# Altium project РЕУН.468172.001_Драйвер лазера.PrjPCB
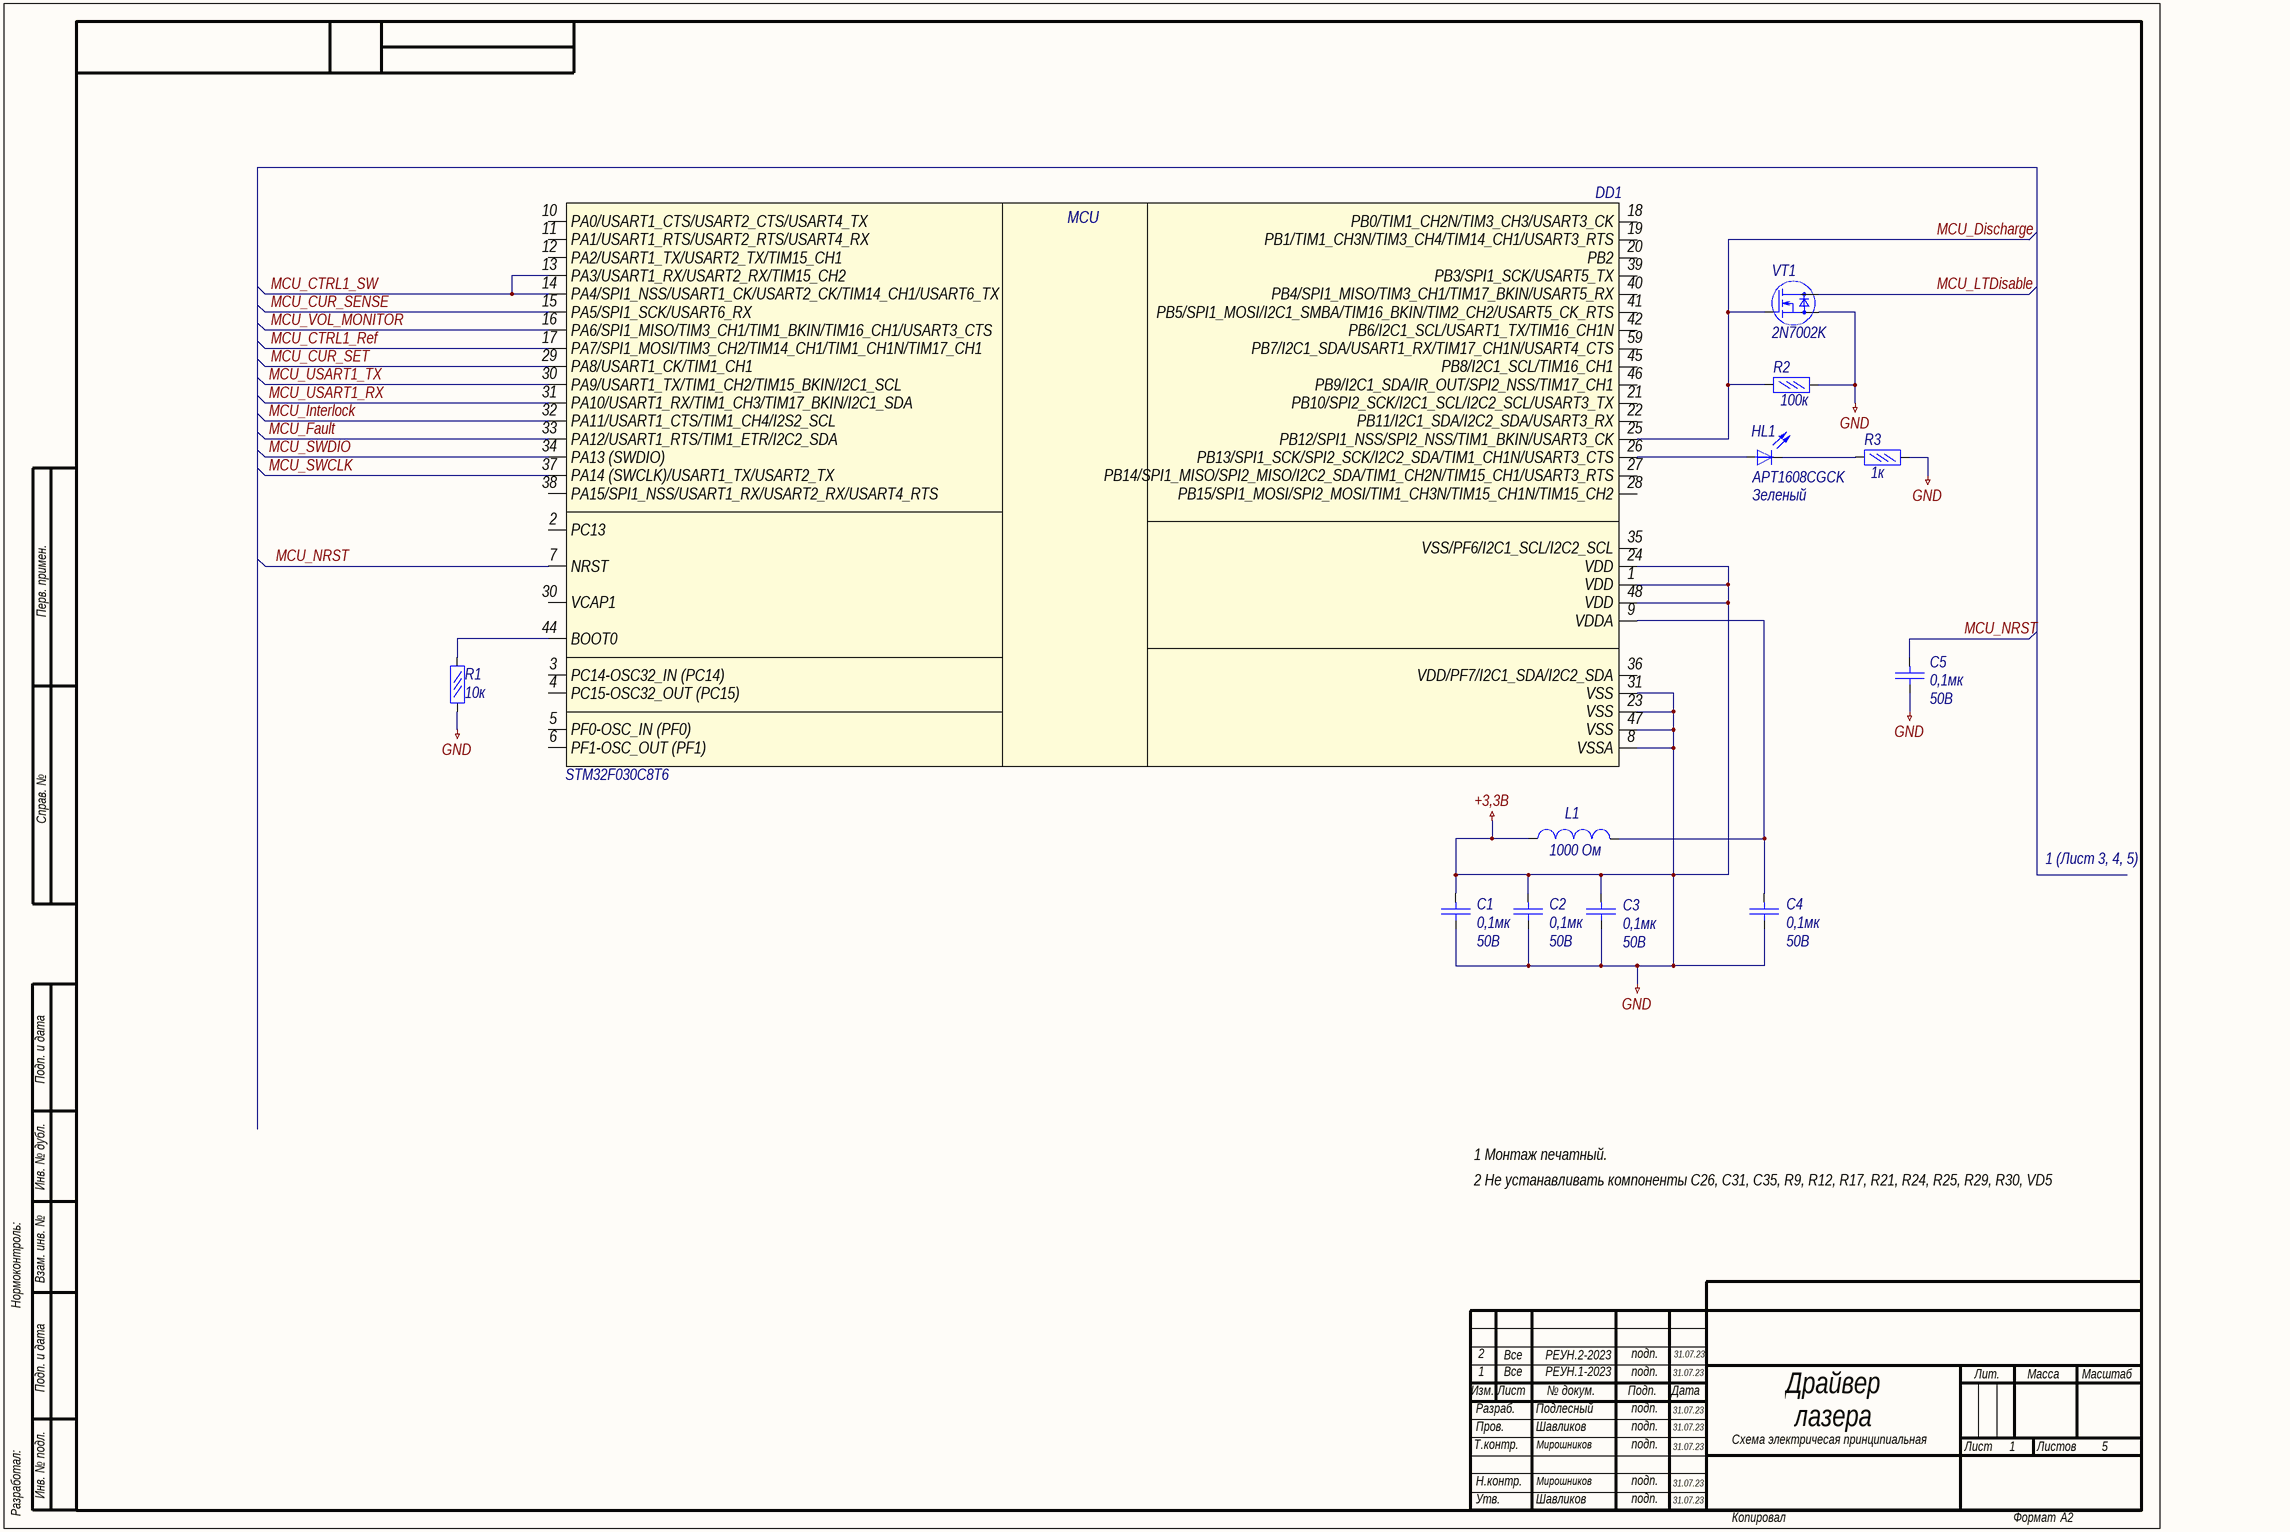
[diagram p0: РЕУН.468172.001_MCU.SchDoc]
5 sheets, 110 parts. Net scope: global (net labels, ports and power ports of the same name join across sheets).
Sheets:
  РЕУН.468172.001_MCU.SchDoc
  РЕУН.468172.001_Power.SchDoc
  РЕУН.468172.001_Int.SchDoc
  РЕУН.468172.001_Interface.SchDoc
  РЕУН.468172.001_Connectors.SchDoc

## Sheet РЕУН.468172.001_MCU.SchDoc: Драйвер
size 594 x 420 mm; ApprovedBy: Шавликов; CheckedBy: Шавликов; DrawnBy: Подлесный; DocumentNumber: РЕУН.468172.001 Э3 2D; SheetNumber: 1; SheetTotal: 5; Вид изделия: Документация; Раздел: Документация; Код документа: Э3; Вид документа: Схема электрическая принципиальная; Класс документа: Конструкторский документ; Создавать изделие в PLM: Yes; DocumentCode: РЕУН.468172.001 Э3 2D; DocumentView: Схема электрическая принципиальная; DocumentClass: Конструкторский документ; ProductView: Документация; DocName: Драйвер; Title_2: лазера; DocumentType: Схема электричесая принципиальная; Format: А2; Designation: РЕУН.468172.001 ТЭ; ImagePath: РЕУН.468172.001 ТЭ

### Parts
C1  Voltage: 50В  [C0805_AA]  (hidden comment: 0,1мк)
C2  Voltage: 50В  [C0805_AA]  (hidden comment: 0,1мк)
C3  Voltage: 50В  [C0805_AA]  (hidden comment: 0,1мк)
C4  Voltage: 50В  [C0805_AA]  (hidden comment: 0,1мк)
C5  Voltage: 50В  [C0805_AA]  (hidden comment: 0,1мк)
DD1  STM32F030C8T6
HL1  Color: Зеленый  (hidden comment: APT1608CGCK)
L1  1000 Ом  [L0603_A]
R1  10к  [R1206]
R2  100к  [R1206]
R3  1к  [R1206]
VT1  2N7002K  [SOT23-3]

### Nets
+3,3В: C1.1 C1.2 C2.1 C2.2 C3.1 C3.2 C4.1 C5.1 DD1.1(VDD) DD1.8(VSSA) DD1.23(VSS) DD1.24(VDD) DD1.31(VSS) DD1.47(VSS) DD1.48(VDD) L1.1 R1.1 R2.1 R3.1 VT1.2(S)  [also labelled GND]
MCU_CTRL1_Ref: DD1.17(PA7/SPI1_MOSI/TIM3_CH2/TIM14_CH1/TIM1_CH1N/TIM17_CH1)
MCU_CTRL1_SW: DD1.13(PA3/USART1_RX/USART2_RX/TIM15_CH2) DD1.14(PA4/SPI1_NSS/USART1_CK/USART2_CK/TIM14_CH1/USART6_TX)
MCU_CUR_SENSE: DD1.15(PA5/SPI1_SCK/USART6_RX)
MCU_CUR_SET: DD1.29(PA8/USART1_CK/TIM1_CH1)
MCU_Discharge: DD1.25(PB12/SPI1_NSS/SPI2_NSS/TIM1_BKIN/USART3_CK) R2.2 VT1.1(G)
MCU_Fault: DD1.33(PA12/USART1_RTS/TIM1_ETR/I2C2_SDA)
MCU_Interlock: DD1.32(PA11/USART1_CTS/TIM1_CH4/I2S2_SCL)
MCU_LTDisable: VT1.3(D)
MCU_NRST: C5.2 DD1.7(NRST)
MCU_SWCLK: DD1.37(PA14_(SWCLK)/USART1_TX/USART2_TX)
MCU_SWDIO: DD1.34(PA13_(SWDIO))
MCU_USART1_RX: DD1.31(PA10/USART1_RX/TIM1_CH3/TIM17_BKIN/I2C1_SDA)
MCU_USART1_TX: DD1.30(PA9/USART1_TX/TIM1_CH2/TIM15_BKIN/I2C1_SCL)
MCU_VOL_MONITOR: DD1.16(PA6/SPI1_MISO/TIM3_CH1/TIM1_BKIN/TIM16_CH1/USART3_CTS)
NetC4_2: C4.2 DD1.9(VDDA) L1.2
NetDD1_26: DD1.26(PB13/SPI1_SCK/SPI2_SCK/I2C2_SDA/TIM1_CH1N/USART3_CTS) HL1.1(A)
NetDD1_44: DD1.44(BOOT0) R1.2
NetHL1_2: HL1.2(K) R3.2

Not connected (* = marked no-connect by the designer): DD1 2(PC13) 3(PC14-OSC32_IN_(PC14)) 4(PC15-OSC32_OUT_(PC15)) 5(PF0-OSC_IN_(PF0)) 6(PF1-OSC_OUT_(PF1)) 10(PA0/USART1_CTS/USART2_CTS/USART4_TX) 11(PA1/USART1_RTS/USART2_RTS/USART4_RX) 12(PA2/USART1_TX/USART2_TX/TIM15_CH1) 18(PB0/TIM1_CH2N/TIM3_CH3/USART3_CK) 19(PB1/TIM1_CH3N/TIM3_CH4/TIM14_CH1/USART3_RTS) 20(PB2) 21(PB10/SPI2_SCK/I2C1_SCL/I2C2_SCL/USART3_TX) 22(PB11/I2C1_SDA/I2C2_SDA/USART3_RX) 27(PB14/SPI1_MISO/SPI2_MISO/I2C2_SDA/TIM1_CH2N/TIM15_CH1/USART3_RTS) 28(PB15/SPI1_MOSI/SPI2_MOSI/TIM1_CH3N/TIM15_CH1N/TIM15_CH2) 35(VSS/PF6/I2C1_SCL/I2C2_SCL) 36(VDD/PF7/I2C1_SDA/I2C2_SDA) 38(PA15/SPI1_NSS/USART1_RX/USART2_RX/USART4_RTS) 39(PB3/SPI1_SCK/USART5_TX) 40(PB4/SPI1_MISO/TIM3_CH1/TIM17_BKIN/USART5_RX) 41(PB5/SPI1_MOSI/I2C1_SMBA/TIM16_BKIN/TIM2_CH2/USART5_CK_RTS) 42(PB6/I2C1_SCL/USART1_TX/TIM16_CH1N) 45(PB8/I2C1_SCL/TIM16_CH1) 46(PB9/I2C1_SDA/IR_OUT/SPI2_NSS/TIM17_CH1) 59(PB7/I2C1_SDA/USART1_RX/TIM17_CH1N/USART4_CTS)

### Notes on the sheet
- 1 (Лист 3, 4, 5)
- 1 Монтаж печатный.
- 2 Не устанавливать компоненты C26, C31, C35, R9, R12, R17, R21, R24, R25, R29, R30, VD5
- 2
- Все
- РЕУН.2-2023
- подп.
- 31.07.23
- 1
- РЕУН.1-2023
- Мирошников
- Перв. примен.
- Справ. №
- Подп. и дата
- Инв. № дубл.
- Нормоконтроль:
- Взам. инв. №
- Изм.
- Лист
- № докум.
- Подп.
- Дата
- Лит.
- Масса
- Масштаб
- Т.контр.
- Пров.
- Разраб.
- Листов
- Разработал:
- Инв. № подл.
- Н.контр.
- Утв.
- Копировал
- Формат
- (in symbol STM32F030C8T6) MCU

### Library data of the parts
C1-C5 = Конденсатор кер.: Name: CC0603KRX7R9BB104; Value: 0,1мк
DD1 = STM32F030C8T6: 32-битный микроконтроллер; Name: STM32F030C8T6
HL1 = led: Светодиод; Name: APT1608CGCK
L1 = Inductor: Катушка индуктивности; Name: BLM18TG102TN1D; Value: 1000 Ом
R1-R3 = Резистор  0,05Вт: Резистор 0,05Вт; Name: RC0603FR-0710KL; Power rating: 0,05Вт
  R1: Value: 10к
  R2: Value: 100к
  R3: Value: 1к
VT1 = mosfet-n: Name: 2N7002K

## Sheet РЕУН.468172.001_Power.SchDoc: =Name-1str
size 420 x 297 mm; SheetNumber: 2; Вид изделия: Документация; Раздел: Документация; Код документа: Э3; Вид документа: Схема электрическая принципиальная; Класс документа: Конструкторский документ; Создавать изделие в PLM: Yes; DocumentCode: РЕУН.468172.001 Э3 2D; DocumentView: Схема электрическая принципиальная; DocumentClass: Конструкторский документ; ProductView: Документация; Format: А3
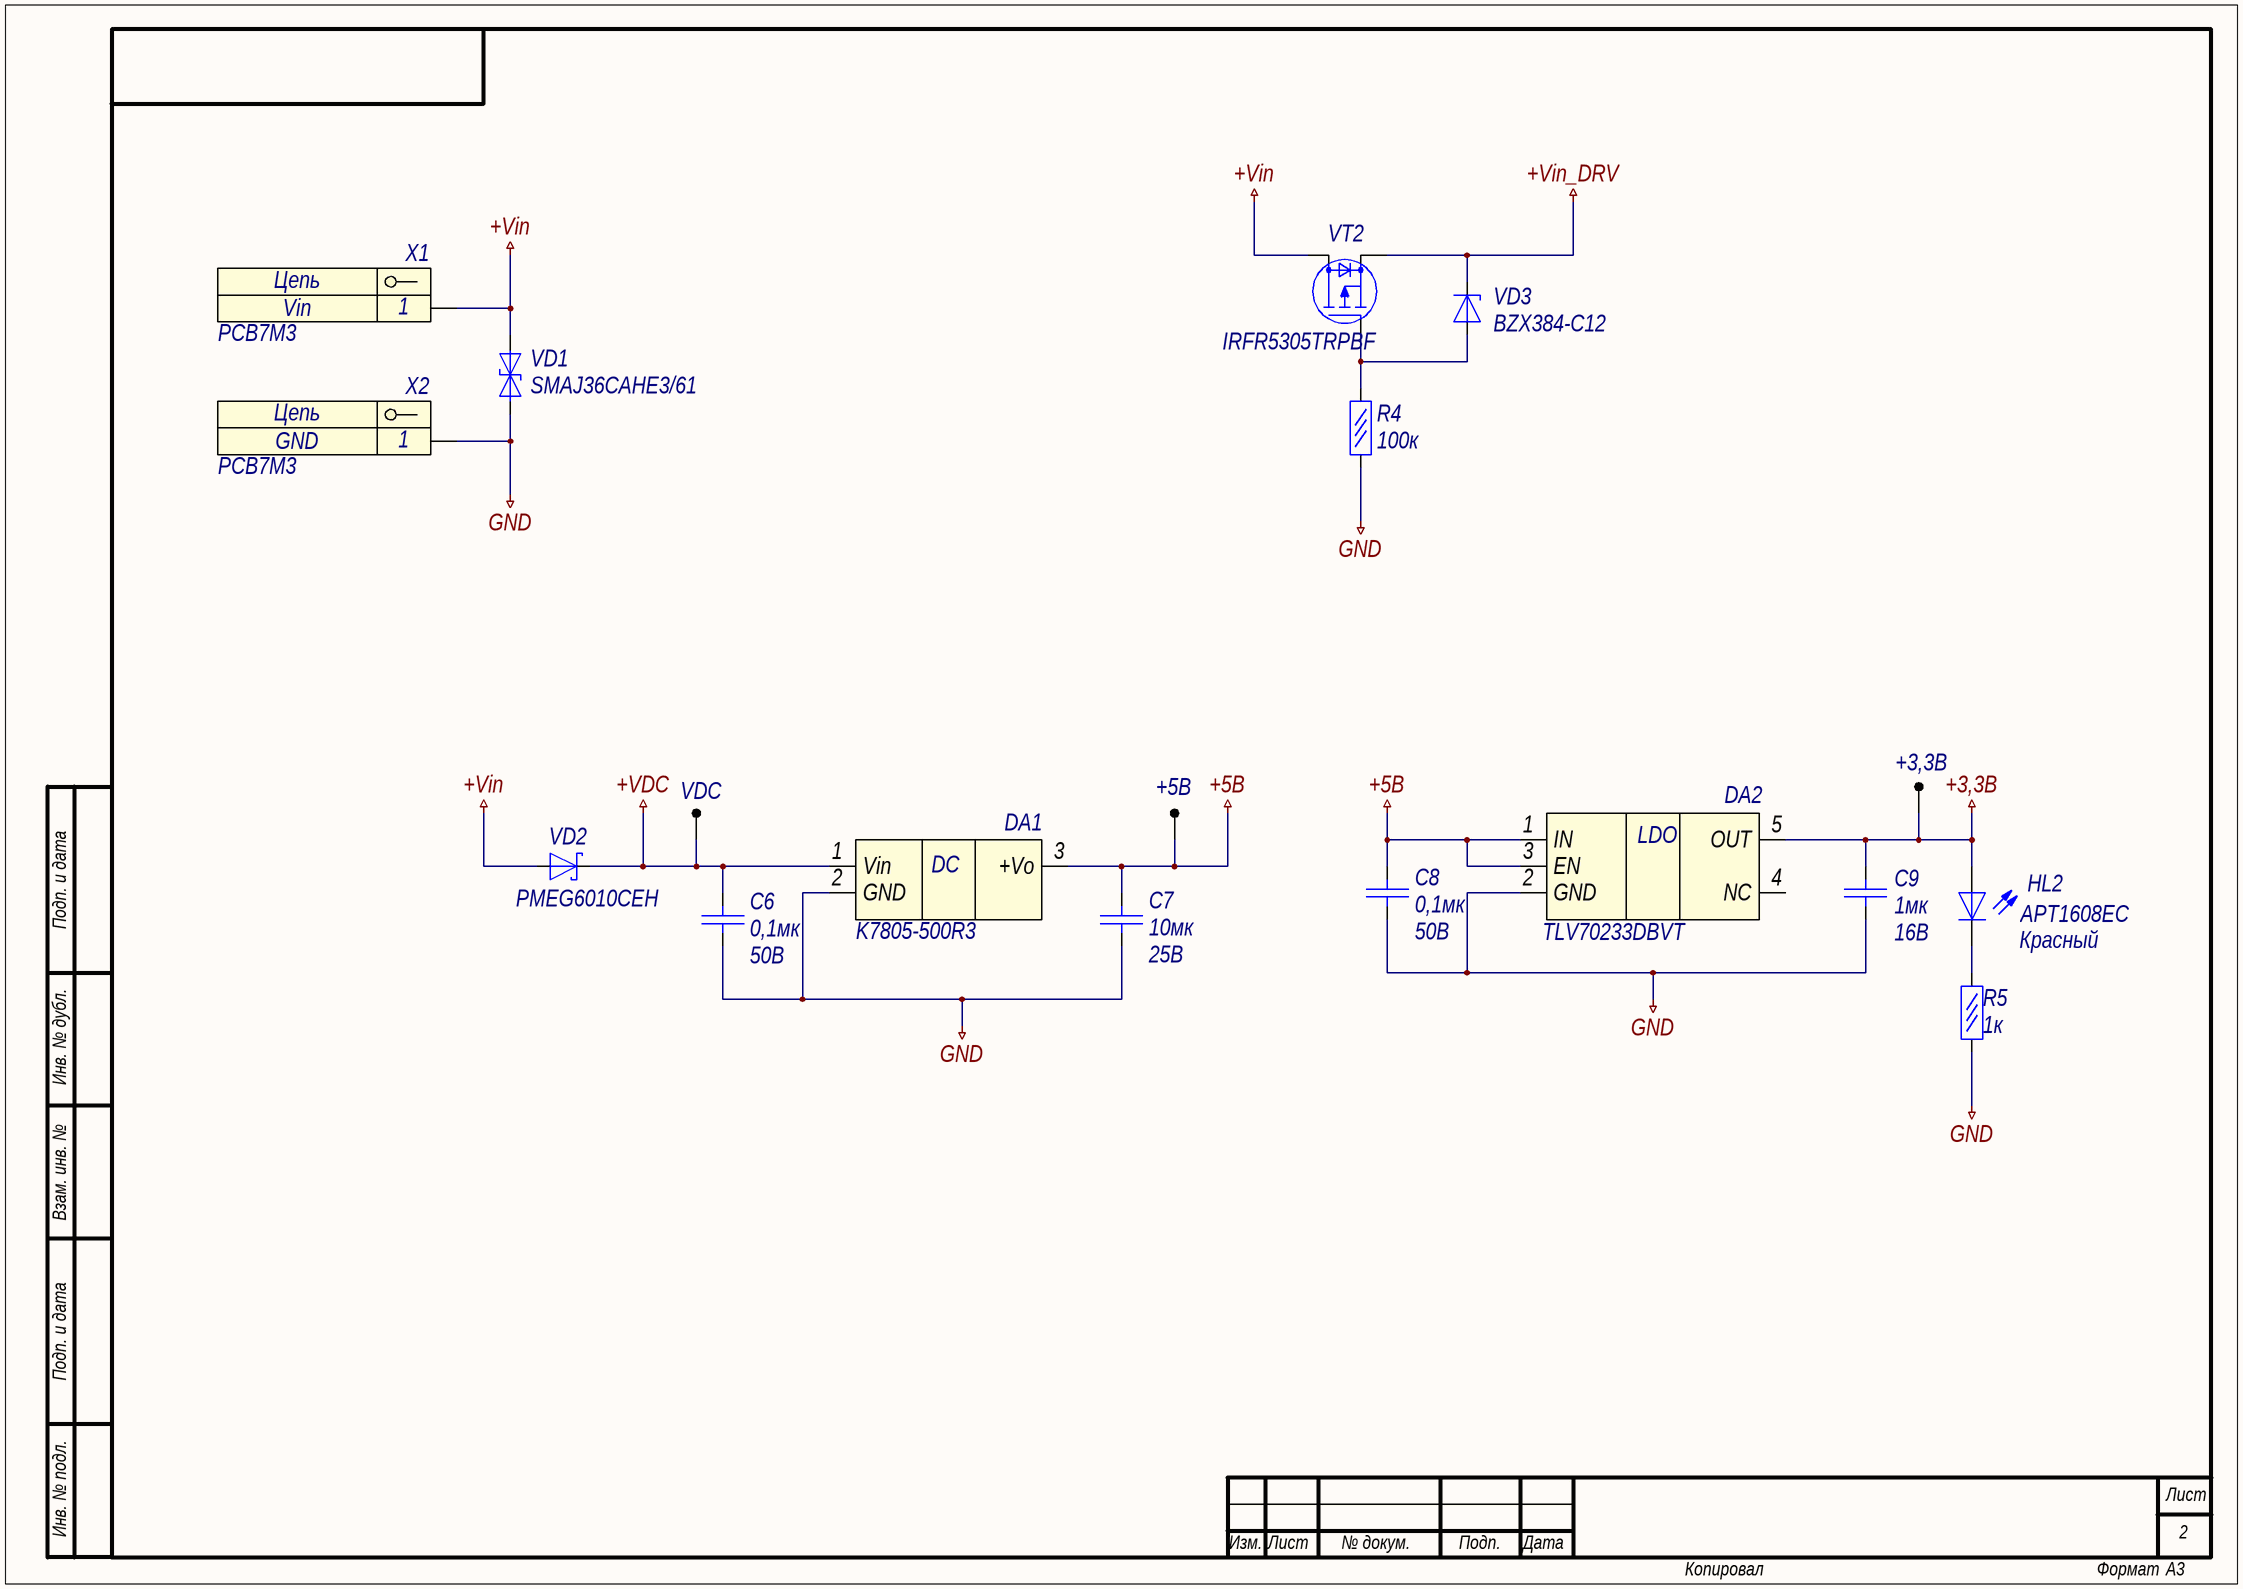
[diagram p1: РЕУН.468172.001_Power.SchDoc]

### Parts
+3,3В  "1"  [0.5 x 1_round]  (value not drawn)
+5В  "1"  [0.5 x 1_round]  (value not drawn)
C6  Voltage: 50В  [C0805_AA]  (hidden comment: 0,1мк)
C7  Voltage: 25В  [C0805_AA]  (hidden comment: 10мк)
C8  Voltage: 50В  [C0805_AA]  (hidden comment: 0,1мк)
C9  Voltage: 16В  [C0805_AA]  (hidden comment: 1мк)
DA1  K7805-500R3
DA2  TLV70233DBVT
HL2  APT1608EC  Vr: Красный  [D0603_A]
R4  100к  [R1206]
R5  1к  [R1206]
VD1  SMAJ36CAHE3/61
VD2  PMEG6010CEH  [SOD123_A]
VD3  BZX384-C12  [SOT23-2_A]
VDC  "1"  [0.5 x 1_round]  (value not drawn)
VT2  IRFR5305TRPBF  [SOT23-3_A]
X1  PCB7M3
X2  PCB7M3

### Nets
+3,3В: +3,3В.1 C6.1 C7.1 C8.1 C9.1 C9.2 DA1.2(GND) DA2.2(GND) DA2.5(OUT) HL2.1(Анод) R4.1 R5.1 VD1.1(A) X2.1  [also labelled GND]
+5В: +5В.1 C7.2 C8.2 DA1.3(+Vo) DA2.1(IN) DA2.3(EN)
+VDC: C6.2 DA1.1(Vin) VD2.1(K) VDC.1
+Vin: VD1.2(K) VD2.2(A) VT2.3(D) X1.1
+Vin_DRV: VD3.1(K) VT2.2(S)
NetHL2_2: HL2.2(Катод) R5.2
NetR4_2: R4.2 VD3.2(A) VT2.1(G)

Not connected (* = marked no-connect by the designer): DA2 4(NC)

### Notes on the sheet
- Подп. и дата
- Инв. № дубл.
- Взам. инв. №
- Инв. № подл.
- Лист
- Изм.
- № докум.
- Подп.
- Дата
- Копировал
- Формат
- (in symbol K78xx-500R3) DC
- (in symbol TLV702) LDO
- (in symbol x1-k) Цепь

### Library data of the parts
+3,3В +5В VDC = TestPoint: Test point; Comment_1: "1"
C6 C8 = Конденсатор кер.: Name: CC0603KRX7R9BB104; Value: 0,1мк
C7 = Конденсатор кер.: Name: CC1206KKX5R8BB106; Value: 10мк
C9 = Конденсатор кер.: Name: CC0603KRX7R7BB105; Value: 1мк
DA1 = K78xx-500R3: DC/DC преобразователь неизолированный
DA2 = TLV702: LDO Regulator
HL2 = LED_R: Светодиод; Name: APT1608EC
R4 = Резистор  0,05Вт: Резистор 0,05Вт; Name: RC0603FR-07100KL; Power rating: 0,05Вт; Value: 100к
R5 = Резистор  0,05Вт: Резистор 0,05Вт; Name: RC0603FR-071KL; Power rating: 0,05Вт; Value: 1к
VD1 = diode-2tvs: Ограничитель напряжения односторонний; Name: SMAJ36CAHE3/61
VD2 = DiodeSchottky: Диод Шоттки; Name: PMEG6010CEH
VD3 = DiodeZener: Стабилитрон; Name: BZX384-C12
VT2 = P-MOSFET: Name: IRFR5305TRPBF; Vds: *; Vgs: *; Ids: *
X1 = x1-k: Разъем - 1 конт. клемма; Contact_1: Vin; Name: PCB7M3
X2 = x1-k: Разъем - 1 конт. клемма; Contact_1: GND; Name: PCB7M3

## Sheet РЕУН.468172.001_Int.SchDoc: =Name-1str
size 840 x 594 mm; SheetNumber: 3; Вид изделия: Документация; Раздел: Документация; Код документа: Э3; Вид документа: Схема электрическая принципиальная; Класс документа: Конструкторский документ; Создавать изделие в PLM: Yes; DocumentCode: РЕУН.468172.001 Э3 2D; DocumentView: Схема электрическая принципиальная; DocumentClass: Конструкторский документ; ProductView: Документация; Format: А1
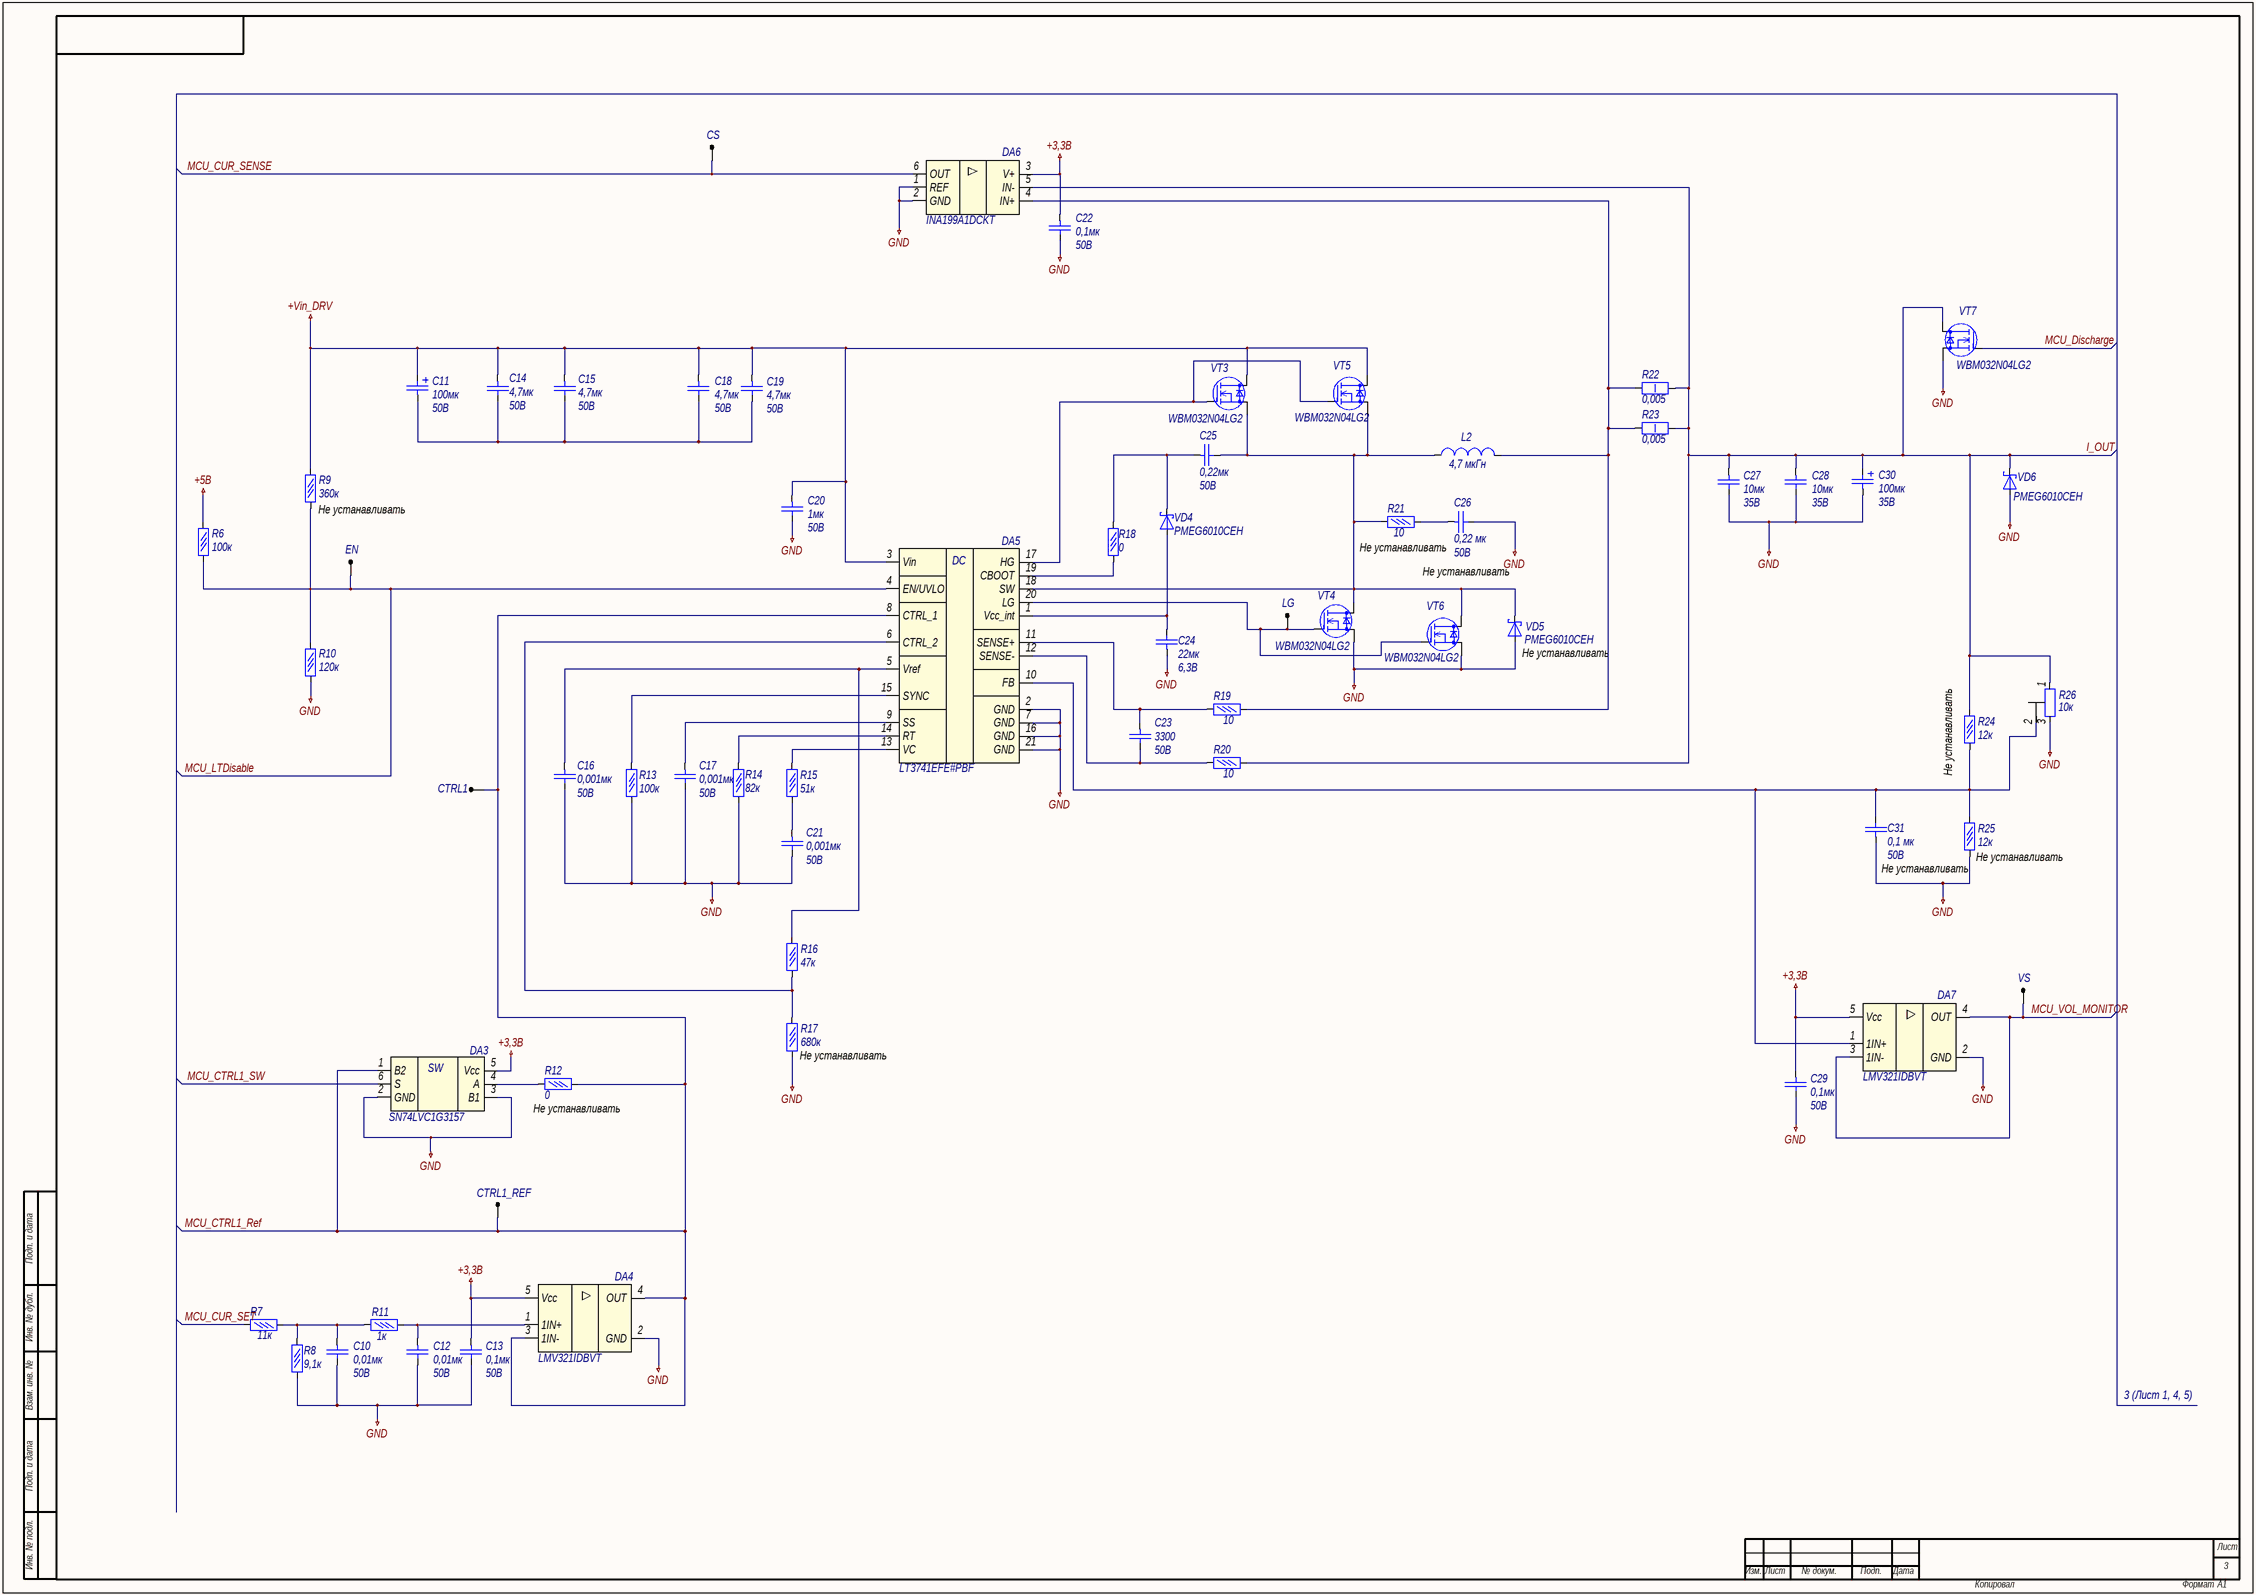
[diagram p2: РЕУН.468172.001_Int.SchDoc]

### Parts
C10  Voltage: 50В  [C0805_AA]  (hidden comment: 0,01мк)
C11  Voltage: 50В  [C0805_AA]  (hidden comment: 100мк)
C12  Voltage: 50В  [C0805_AA]  (hidden comment: 0,01мк)
C13  Voltage: 50В  [C0805_AA]  (hidden comment: 0,1мк)
C14  Voltage: 50В  [C0805_AA]  (hidden comment: 4,7мк)
C15  Voltage: 50В  [C0805_AA]  (hidden comment: 4,7мк)
C16  Voltage: 50В  [C0805_AA]  (hidden comment: 0,001мк)
C17  Voltage: 50В  [C0805_AA]  (hidden comment: 0,001мк)
C18  Voltage: 50В  [C0805_AA]  (hidden comment: 4,7мк)
C19  Voltage: 50В  [C0805_AA]  (hidden comment: 4,7мк)
C20  Voltage: 50В  [C0805_AA]  (hidden comment: 1мк)
C21  Voltage: 50В  [C0805_AA]  (hidden comment: 0,001мк)
C22  Voltage: 50В  [C0805_AA]  (hidden comment: 0,1мк)
C23  Voltage: 50В  [C0805_AA]  (hidden comment: 3300)
C24  Voltage: 6,3В  [C0805_AA]  (hidden comment: 22мк)
C25  Voltage: 50В  [C0805_AA]  (hidden comment: 0,22мк)
C26  Voltage: 50В  [C0805_AA]  (hidden comment: 0,22 мк)
C27  Voltage: 35В  [C0805_AA]  (hidden comment: 10мк)
C28  Voltage: 35В  [C0805_AA]  (hidden comment: 10мк)
C29  Voltage: 50В  [C0805_AA]  (hidden comment: 0,1мк)
C30  Voltage: 35В  [C0805_AA]  (hidden comment: 100мк)
C31  Voltage: 50В  [C0805_AA]  (hidden comment: 0,1 мк)
CS  "1"  [0.5 x 1_round]  (value not drawn)
CTRL1  "1"  [0.5 x 1_round]  (value not drawn)
CTRL1_REF  "1"  [0.5 x 1_round]  (value not drawn)
DA3  SN74LVC1G3157
DA4  LMV321IDBVT
DA5  LT3741EFE#PBF
DA6  INA199A1DCKT
DA7  LMV321IDBVT
EN  "1"  [0.5 x 1_round]  (value not drawn)
L2  4,7 мкГн  [L0603_A]
LG  "1"  [0.5 x 1_round]  (value not drawn)
R6  100к  [R1206]
R7  11к  [R1206]
R8  9,1к  [R1206]
R9  360к  [R1206]
R10  120к  [R1206]
R11  1к  [R1206]
R12  0  [R1206]
R13  100к  [R1206]
R14  82к  [R1206]
R15  51к  [R1206]
R16  47к  [R1206]
R17  680к  [R1206]
R18  0  [R1206]
R19  10  [R1206]
R20  10  [R1206]
R21  10  [R1206]
R22  0,005  [R1206]
R23  0,005  [R1206]
R24  12к  [R1206]
R25  12к  [R1206]
R26  10к
VD4  PMEG6010CEH  [SOD123_A]
VD5  PMEG6010CEH  [SOD123_A]
VD6  PMEG6010CEH  [SOD123_A]
VS  "1"  [0.5 x 1_round]  (value not drawn)
VT3  WBM032N04LG2  [КТ-111В-1.02]
VT4  WBM032N04LG2  [КТ-111В-1.02]
VT5  WBM032N04LG2  [КТ-111В-1.02]
VT6  WBM032N04LG2  [КТ-111В-1.02]
VT7  WBM032N04LG2  [КТ-111В-1.02]

### Nets
+3,3В: C10.1 C12.1 C13.1 C13.2 C16.1 C17.1 C20.1 C21.1 C22.1 C22.2 C24.2 C26.1 C27.1 C28.1 C29.1 C29.2 C30.2 C31.2 DA3.2(GND) DA3.3(B1) DA3.5(Vcc) DA4.2(GND) DA4.5(Vcc) DA5.2(GND) DA5.7(GND) DA5.16(GND) DA5.21(GND) DA6.1(REF) DA6.2(GND) DA6.3(V+) DA7.2(GND) DA7.5(Vcc) R8.1 R10.1 R13.1 R14.1 R17.1 R25.1 R26.3 VD5.2(A) VD6.2(A) VT4.2(S) VT6.2(S) VT7.2(S)  [also labelled GND]
+5В: R6.2
+Vin_DRV: C11.1 C14.2 C15.2 C18.2 C19.2 C20.2 DA5.3(Vin) R9.2 VT3.3(D) VT5.3(D)
I_OUT: C27.2 C28.2 C30.1 DA6.5(IN-) R20.2 R22.2 R23.2 R24.2 R26.1 VD6.1(K) VT7.3(D)
MCU_CTRL1_Ref: CTRL1.1 CTRL1_REF.1 DA3.1(B2) DA4.3(1IN-) DA4.4(OUT) DA5.8(CTRL_1) R12.1
MCU_CTRL1_SW: DA3.6(S)
MCU_CUR_SENSE: CS.1 DA6.6(OUT)
MCU_CUR_SET: R7.2
MCU_Discharge: VT7.1(G)
MCU_LTDisable: DA5.4(EN/UVLO) EN.1 R6.1 R9.1 R10.2
MCU_VOL_MONITOR: DA7.3(1IN-) DA7.4(OUT) VS.1
NetC10_2: C10.2 R7.1 R8.2 R11.2
NetC11_2: C11.2 C14.1 C15.1 C18.1 C19.1
NetC12_2: C12.2 DA4.1(1IN+) R11.1
NetC16_2: C16.2 DA5.5(Vref) R16.2
NetC17_2: C17.2 DA5.9(SS)
NetC21_2: C21.2 R15.1
NetC23_1: C23.1 DA5.12(SENSE-) R20.1
NetC23_2: C23.2 DA5.11(SENSE+) R19.1
NetC24_1: C24.1 DA5.1(Vcc_int) VD4.2(A)
NetC25_1: C25.1 DA5.18(SW) L2.1 R21.1 VD5.1(K) VT3.2(S) VT4.3(D) VT5.2(S) VT6.3(D)
NetC25_2: C25.2 R18.2 VD4.1(K)
NetC26_2: C26.2 R21.2
NetC31_1: C31.1 DA5.10(FB) DA7.1(1IN+) R24.1 R25.2 R26.2
NetDA3_4: DA3.4(A) R12.2
NetDA5_6: DA5.6(CTRL_2) R16.1 R17.2
NetDA5_13: DA5.13(VC) R15.2
NetDA5_14: DA5.14(RT) R14.2
NetDA5_15: DA5.15(SYNC) R13.2
NetDA5_17: DA5.17(HG) VT3.1(G) VT5.1(G)
NetDA5_19: DA5.19(CBOOT) R18.1
NetDA5_20: DA5.20(LG) LG.1 VT4.1(G) VT6.1(G)
NetDA6_4: DA6.4(IN+) L2.2 R19.2 R22.1 R23.1

### Notes on the sheet
- (near R9) Не устанавливать
- Не устанавливать
- (near VD5) Не устанавливать
- (near R24) Не устанавливать
- (near R25) Не устанавливать
- (near R17) Не устанавливать
- (near R12) Не устанавливать
- 3 (Лист 1, 4, 5)
- Подп. и дата
- Инв. № дубл.
- Взам. инв. №
- Инв. № подл.
- Лист
- Изм.
- № докум.
- Подп.
- Дата
- Копировал
- Формат
- (in symbol LT3741) DC
- (in symbol SN74LVC1G3157) SW

### Library data of the parts
C10 C12 C13 C22 C29 = Конденсатор кер.: Name: CC0603KRX7R9BB104
  C10 C12: Value: 0,01мк
  C13 C22 C29: Value: 0,1мк
C11 = Конденсатор поляризованный: Конденсатор пол.; Name: EEHZC1H101P; Value: 100мк
C14 C15 C18 C19 = Конденсатор кер.: Name: C1210C475K5RACTU; Value: 4,7мк
C16 = Конденсатор кер.: Name: CC0603KRX7R9BB102; Value: 0,001мк
C17 C21 = Конденсатор кер.: Name: CC0603KRX7R9BB103; Value: 0,001мк
C20 = Конденсатор кер.: Name: 08055D105KAT2A; Value: 1мк
C23 = Конденсатор кер.: Name: CC0603KRX7R9BB333; Value: 3300
C24-C26 C31 = Конденсатор кер.: Name: CC0603ZRY5V9BB224
  C24: Value: 22мк
  C25: Value: 0,22мк
  C26: Value: 0,22 мк
  C31: Value: 0,1 мк
C27 C28 = Конденсатор кер.: Name: C1210C476M4PACTU; Value: 10мк
C30 = Конденсатор поляризованный: Конденсатор пол.; Name: EEE-FP1A221AP; Value: 100мк
CS CTRL1 CTRL1_REF EN LG VS = TestPoint: Test point; Comment_1: "1"
DA3 = SN74LVC1G3157: Аналоговый переключатель, двухпозиционный
DA4 DA7 = LMV321: Операционный усилитель Rail-to-rail
DA5 = LT3741: Step-Down Controller, Constant Voltage
DA6 = INA199: Voltage output current shunt monitor
L2 = Inductor: Катушка индуктивности; Name: 7443551130; Value: 4,7 мкГн
R6 R9 = Резистор  0,05Вт: Резистор 0,05Вт; Name: RC0603FR-07360KL; Power rating: 0,05Вт
  R6: Value: 100к
  R9: Value: 360к
R7 = Резистор  0,05Вт: Резистор 0,05Вт; Name: RC0603FR-0711KL; Power rating: 0,05Вт; Value: 11к
R8 = Резистор  0,05Вт: Резистор 0,05Вт; Name: 'RC0603FR-079K1L; Power rating: 0,05Вт; Value: 9,1к
R10 = Резистор  0,05Вт: Резистор 0,05Вт; Name: RC0603FR-07120KL; Power rating: 0,05Вт; Value: 120к
R11 = Резистор  0,05Вт: as R1 on sheet РЕУН.468172.001_MCU; Value: 1к
R12 R17-R20 = Резистор  0,05Вт: Резистор 0,05Вт; Name: RC0603FR-07680KL; Power rating: 0,05Вт
  R12 R18: Value: 0
  R17: Value: 680к
  R19 R20: Value: 10
R13 R14 = Резистор  0,05Вт: as R4 on sheet РЕУН.468172.001_Power
  R13: Value: 100к
  R14: Value: 82к
R15 R24 R25 = Резистор  0,05Вт: Резистор 0,05Вт; Name: RT0603DRD0765K5L; Power rating: 0,05Вт
  R15: Value: 51к
  R24 R25: Value: 12к
R16 = Резистор  0,05Вт: Резистор 0,05Вт; Name: RC0603FR-0745K3L; Power rating: 0,05Вт; Value: 47к
R21 = Резистор  0,05Вт: Резистор 0,05Вт; Name: RC0603FR-0710RL; Power rating: 0,05Вт; Value: 10
R22 R23 = Резистор  1Вт: Name: CRCW2512100KFKEG; Power rating: 1Вт; Value: 0,005
R26 = Potentiometer
VD4-VD6 = DiodeSchottky: Диод Шоттки; Name: PMEG6010CEH
VT3-VT7 = N-Mosfet: N-канальный транзистор; Vgs: *; Rds: *; Vds: *; Name: WBM032N04LG2

## Sheet РЕУН.468172.001_Interface.SchDoc: =Name-1str
size 420 x 297 mm; SheetNumber: 4; Вид изделия: Документация; Раздел: Документация; Код документа: Э3; Вид документа: Схема электрическая принципиальная; Класс документа: Конструкторский документ; Создавать изделие в PLM: Yes; DocumentCode: РЕУН.468172.001 Э3 2D; DocumentView: Схема электрическая принципиальная; DocumentClass: Конструкторский документ; ProductView: Документация; Format: А3
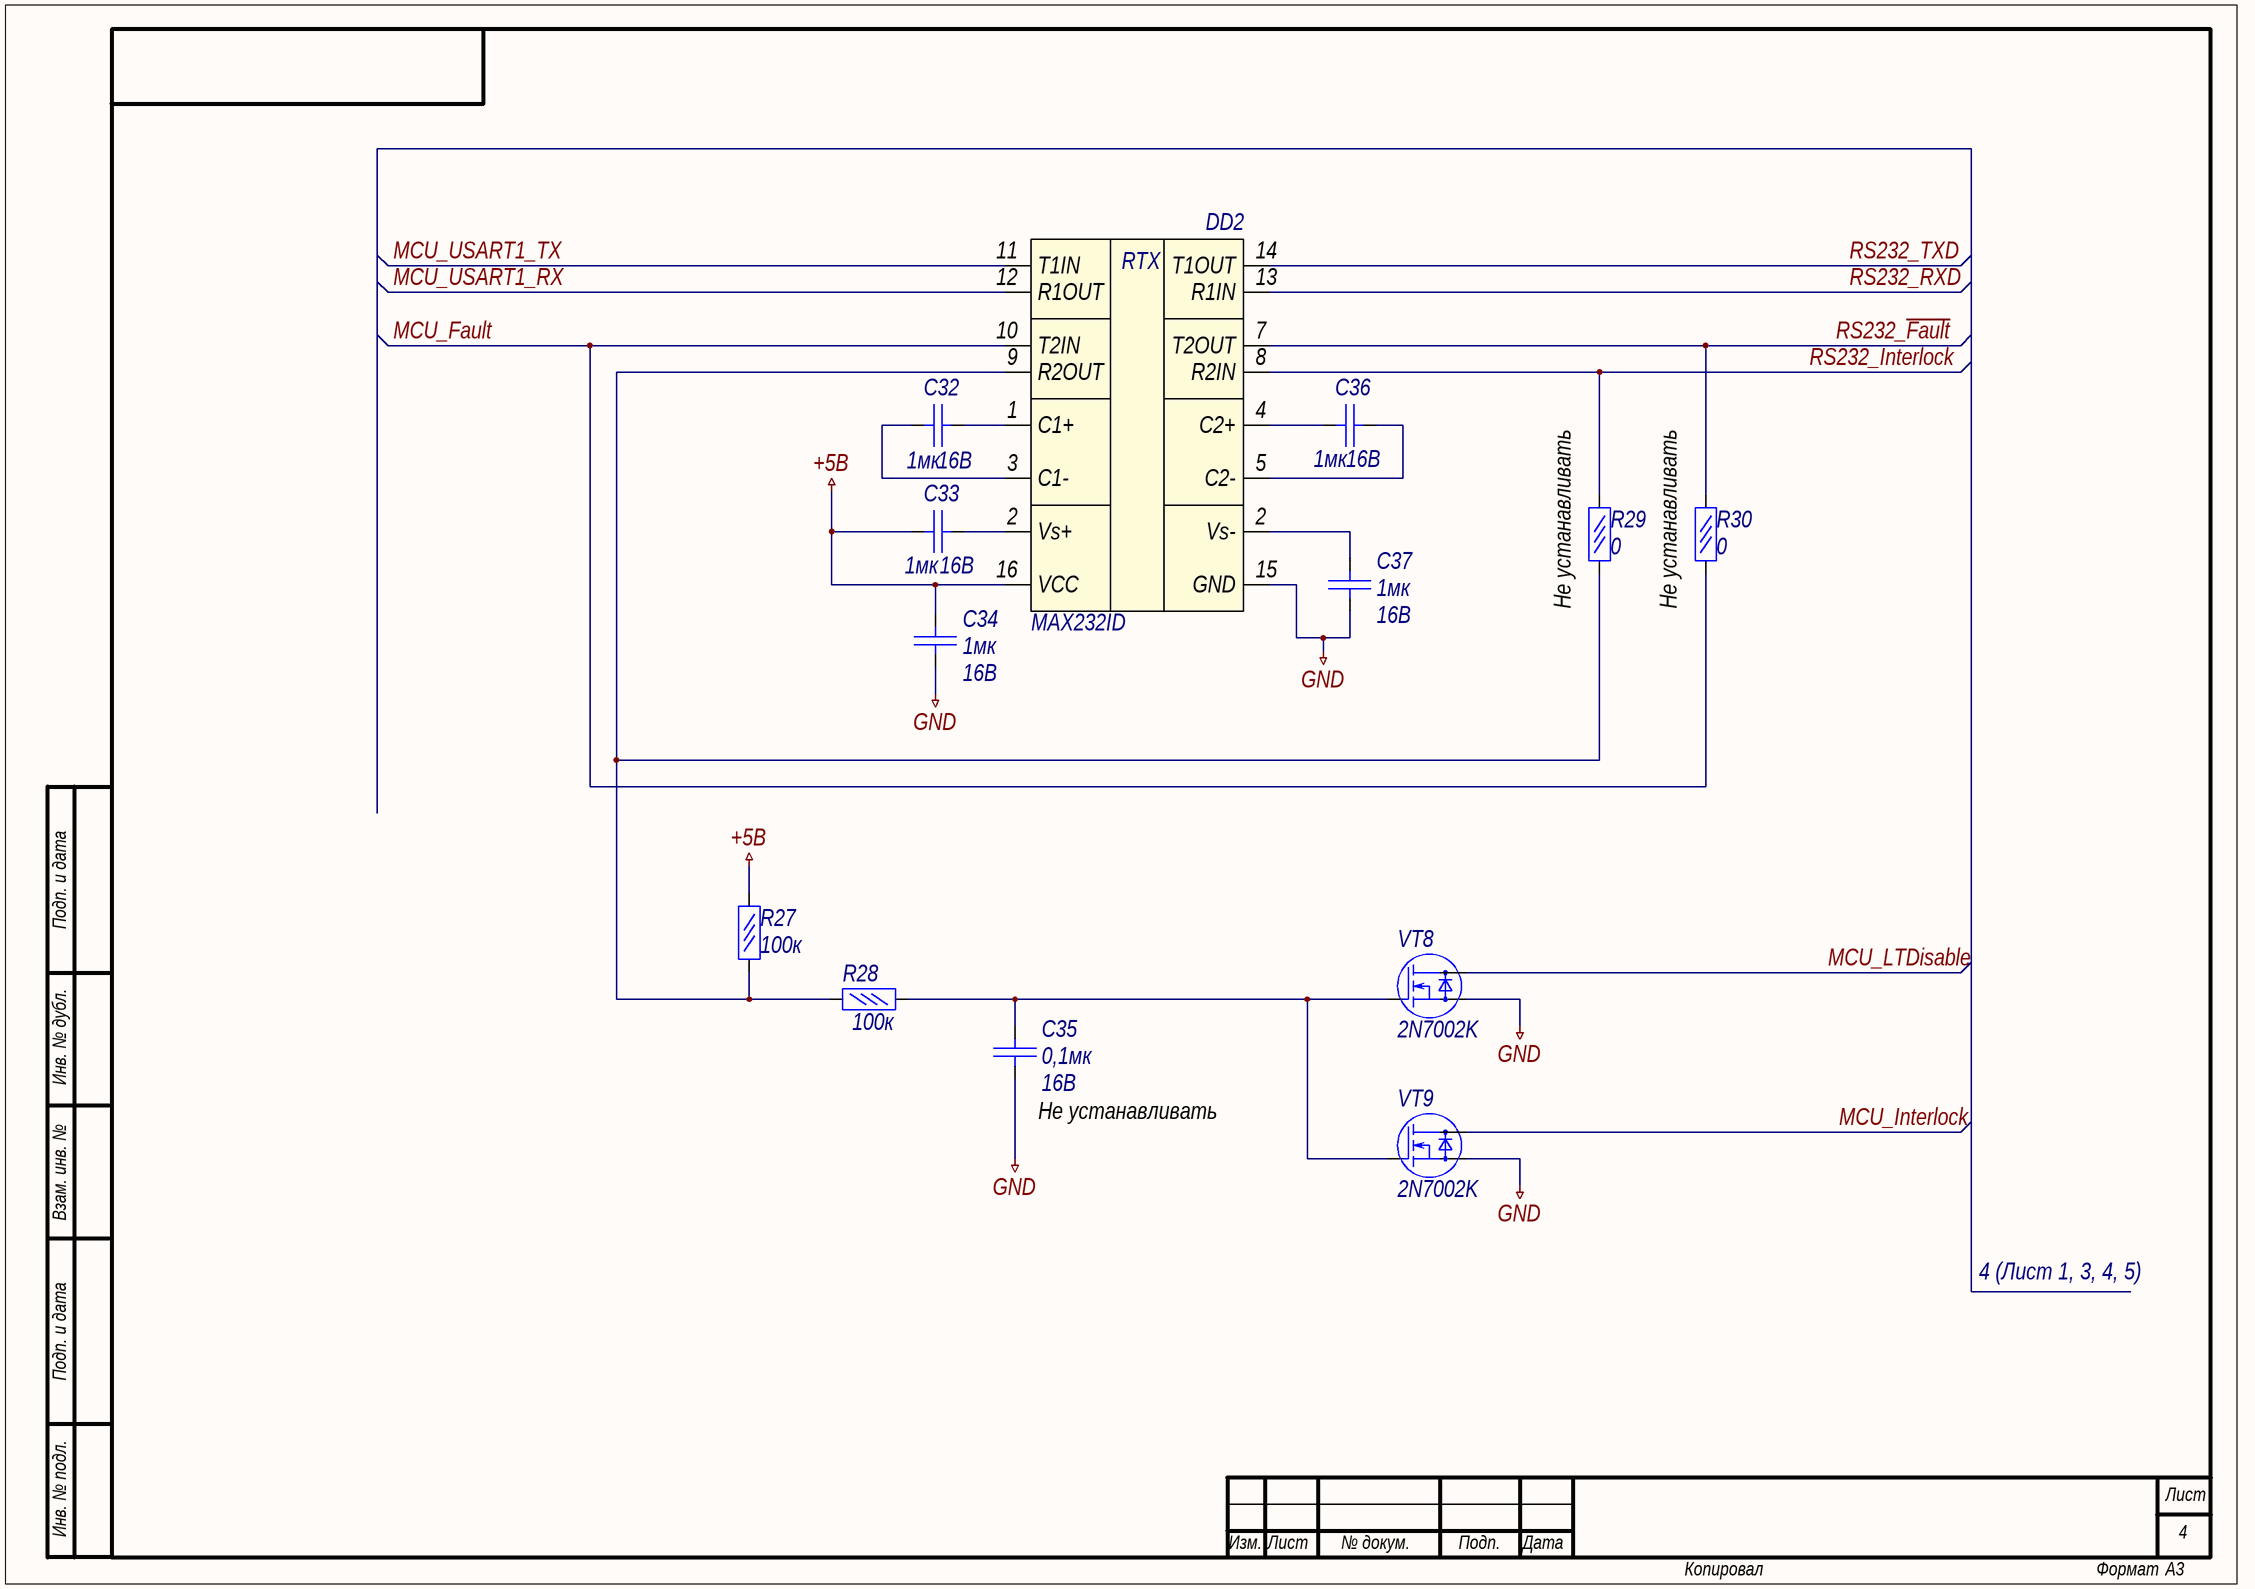
[diagram p3: РЕУН.468172.001_Interface.SchDoc]

### Parts
C32  Voltage: 16В  [C0805_AA]  (hidden comment: 1мк)
C33  Voltage: 16В  [C0805_AA]  (hidden comment: 1мк)
C34  Voltage: 16В  [C0805_AA]  (hidden comment: 1мк)
C35  Voltage: 16В  [C0805_AA]  (hidden comment: 0,1мк)
C36  Voltage: 16В  [C0805_AA]  (hidden comment: 1мк)
C37  Voltage: 16В  [C0805_AA]  (hidden comment: 1мк)
DD2  MAX232ID
R27  100к  [R1206]
R28  100к  [R1206]
R29  0  [R1206]
R30  0  [R1206]
VT8  2N7002K  [SOT23-3]
VT9  2N7002K  [SOT23-3]

### Nets
+5В: C33.2 C34.1 DD2.16(VCC) R27.1
GND: C34.2 C35.2 C37.2 DD2.15(GND) VT8.2(S) VT9.2(S)  [project net +3,3В]
MCU_Fault: DD2.10(T2IN) R30.2
MCU_Interlock: VT9.3(D)
MCU_LTDisable: VT8.3(D)
MCU_USART1_RX: DD2.12(R1OUT)
MCU_USART1_TX: DD2.11(T1IN)
RS232_~{Fault}: DD2.7(T2OUT) R30.1
RS232_Interlock: DD2.8(R2IN) R29.1
RS232_RXD: DD2.13(R1IN)
RS232_TXD: DD2.14(T1OUT)
NetC32_1: C32.1 DD2.1(C1+)
NetC32_2: C32.2 DD2.3(C1-)
NetC33_1: C33.1 DD2.2(Vs+)
NetC35_1: C35.1 R28.1 VT8.1(G) VT9.1(G)
NetC36_1: C36.1 DD2.5(C2-)
NetC36_2: C36.2 DD2.4(C2+)
NetC37_1: C37.1 DD2.2(Vs-)
NetDD2_9: DD2.9(R2OUT) R27.2 R28.2 R29.2

### Notes on the sheet
- (near R29) Не устанавливать
- (near R30) Не устанавливать
- (near C35) Не устанавливать
- 4 (Лист 1, 3, 4, 5)
- Подп. и дата
- Инв. № дубл.
- Взам. инв. №
- Инв. № подл.
- Лист
- Изм.
- № докум.
- Подп.
- Дата
- Копировал
- Формат
- (in symbol MAX232ID) RTX

### Library data of the parts
C32-C37 = Конденсатор кер.: Name: CC0603KRX7R7BB105
  C32-C34 C36 C37: Value: 1мк
  C35: Value: 0,1мк
DD2 = MAX232ID: Dual EIA-232 Drivers/Receivers
R27-R30 = Резистор  0,05Вт: as R1 on sheet РЕУН.468172.001_MCU
  R27 R28: Value: 100к
  R29 R30: Value: 0
VT8 VT9 = mosfet-n: Name: 2N7002K

## Sheet РЕУН.468172.001_Connectors.SchDoc: =Name-1str
size 420 x 297 mm; SheetNumber: 5; Вид изделия: Документация; Раздел: Документация; Код документа: Э3; Вид документа: Схема электрическая принципиальная; Класс документа: Конструкторский документ; Создавать изделие в PLM: Yes; DocumentCode: РЕУН.468172.001 Э3 2D; DocumentView: Схема электрическая принципиальная; DocumentClass: Конструкторский документ; ProductView: Документация; Format: А3
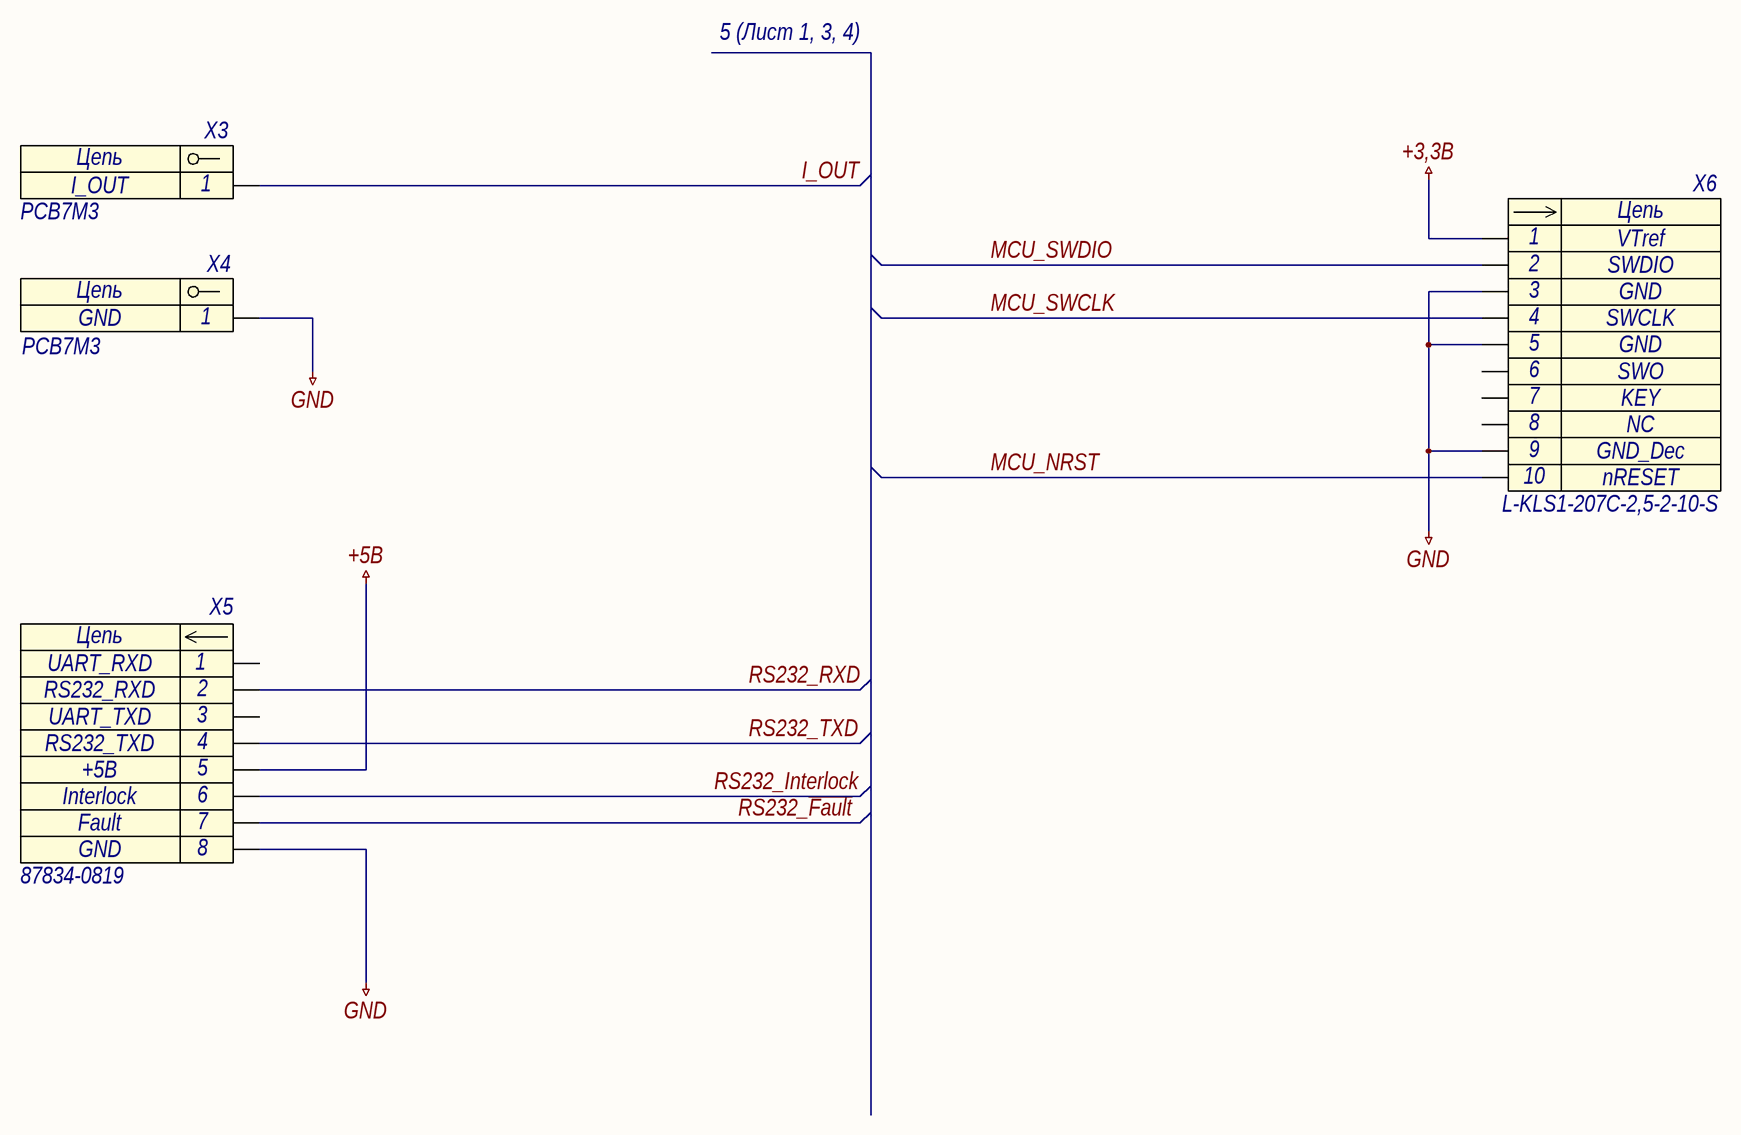
[diagram p4: РЕУН.468172.001_Connectors.SchDoc]

### Parts
X3  PCB7M3
X4  PCB7M3
X5  87834-0819
X6  L-KLS1-207C-2,5-2-10-S

### Nets
+3,3В: X4.1 X5.8 X6.1 X6.3 X6.5 X6.9  [also labelled GND]
+5В: X5.5
I_OUT: X3.1
MCU_NRST: X6.10
MCU_SWCLK: X6.4
MCU_SWDIO: X6.2
RS232_~{Fault}: X5.7
RS232_Interlock: X5.6
RS232_RXD: X5.2
RS232_TXD: X5.4

Not connected (* = marked no-connect by the designer): X5 1 3; X6 6 7 8

### Notes on the sheet
- 5 (Лист 1, 3, 4)
- Подп. и дата
- Инв. № дубл.
- Взам. инв. №
- Инв. № подл.
- Лист
- Изм.
- № докум.
- Подп.
- Дата
- Копировал
- Формат
- (in symbol x1-k) Цепь
- (in symbol x8-m) Цепь
- (in symbol x10-m) Цепь

### Library data of the parts
X3 = x1-k: Разъем - 1 конт. клемма; Contact_1: I_OUT; Name: PCB7M3
X4 = x1-k: Разъем - 1 конт. клемма; Contact_1: GND; Name: PCB7M3
X5 = x8-m: Разъем - 8 конт. вилка; Contact_1: UART_RXD; Contact_2: RS232_RXD; Contact_3: UART_TXD; Contact_4: RS232_TXD; Contact_5: +5В; Contact_6: Interlock; Contact_7: Fault; Contact_8: GND; Name: 87834-0819
X6 = x10-m: Разъем - 10 конт. вилка; Contact_1: VTref; Contact_2: SWDIO; Contact_3: GND; Contact_4: SWCLK; Contact_6: SWO; Contact_7: KEY; Contact_8: NC; Contact_9: GND_Dec; Contact_10: nRESET; Contact_5: GND; Name: L-KLS1-207C-2,5-2-10-S

## Nets that join several sheets
+3,3В: РЕУН.468172.001_MCU (20 pins), РЕУН.468172.001_Power (14 pins), РЕУН.468172.001_Int (44 pins), РЕУН.468172.001_Interface (6 pins), РЕУН.468172.001_Connectors (6 pins)
+5В: РЕУН.468172.001_Power (6 pins), РЕУН.468172.001_Int (R6.2), РЕУН.468172.001_Interface (C33.2 C34.1 DD2.16 R27.1), РЕУН.468172.001_Connectors (X5.5)
+Vin_DRV: РЕУН.468172.001_Power (VD3.1 VT2.2), РЕУН.468172.001_Int (10 pins)
I_OUT: РЕУН.468172.001_Int (11 pins), РЕУН.468172.001_Connectors (X3.1)
MCU_CTRL1_Ref: РЕУН.468172.001_MCU (DD1.17), РЕУН.468172.001_Int (7 pins)
MCU_CTRL1_SW: РЕУН.468172.001_MCU (DD1.13 DD1.14), РЕУН.468172.001_Int (DA3.6)
MCU_CUR_SENSE: РЕУН.468172.001_MCU (DD1.15), РЕУН.468172.001_Int (CS.1 DA6.6)
MCU_CUR_SET: РЕУН.468172.001_MCU (DD1.29), РЕУН.468172.001_Int (R7.2)
MCU_Discharge: РЕУН.468172.001_MCU (DD1.25 R2.2 VT1.1), РЕУН.468172.001_Int (VT7.1)
MCU_Fault: РЕУН.468172.001_MCU (DD1.33), РЕУН.468172.001_Interface (DD2.10 R30.2)
MCU_Interlock: РЕУН.468172.001_MCU (DD1.32), РЕУН.468172.001_Interface (VT9.3)
MCU_LTDisable: РЕУН.468172.001_MCU (VT1.3), РЕУН.468172.001_Int (5 pins), РЕУН.468172.001_Interface (VT8.3)
MCU_NRST: РЕУН.468172.001_MCU (C5.2 DD1.7), РЕУН.468172.001_Connectors (X6.10)
MCU_SWCLK: РЕУН.468172.001_MCU (DD1.37), РЕУН.468172.001_Connectors (X6.4)
MCU_SWDIO: РЕУН.468172.001_MCU (DD1.34), РЕУН.468172.001_Connectors (X6.2)
MCU_USART1_RX: РЕУН.468172.001_MCU (DD1.31), РЕУН.468172.001_Interface (DD2.12)
MCU_USART1_TX: РЕУН.468172.001_MCU (DD1.30), РЕУН.468172.001_Interface (DD2.11)
MCU_VOL_MONITOR: РЕУН.468172.001_MCU (DD1.16), РЕУН.468172.001_Int (DA7.3 DA7.4 VS.1)
RS232_~{Fault}: РЕУН.468172.001_Interface (DD2.7 R30.1), РЕУН.468172.001_Connectors (X5.7)
RS232_Interlock: РЕУН.468172.001_Interface (DD2.8 R29.1), РЕУН.468172.001_Connectors (X5.6)
RS232_RXD: РЕУН.468172.001_Interface (DD2.13), РЕУН.468172.001_Connectors (X5.2)
RS232_TXD: РЕУН.468172.001_Interface (DD2.14), РЕУН.468172.001_Connectors (X5.4)